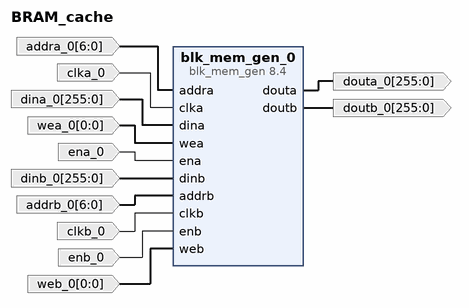
[diagram p0: block diagram of the top level]
# Vivado block design BRAM_cache, xc7s50csga324-2, Vivado 2018.1
create_bd_design BRAM_cache

create_bd_port -dir I -from 6 -to 0 addra_0
create_bd_port -dir I -type clk clka_0
create_bd_port -dir I -from 255 -to 0 dina_0
create_bd_port -dir O -from 255 -to 0 douta_0
create_bd_port -dir I -from 0 -to 0 wea_0
create_bd_port -dir I ena_0
create_bd_port -dir I -from 255 -to 0 dinb_0
create_bd_port -dir O -from 255 -to 0 doutb_0
create_bd_port -dir I -from 6 -to 0 addrb_0
create_bd_port -dir I -type clk clkb_0
create_bd_port -dir I enb_0
create_bd_port -dir I -from 0 -to 0 web_0

create_bd_cell -type ip -vlnv xilinx.com:ip:blk_mem_gen:8.4 blk_mem_gen_0
set_property -dict [list \
  CONFIG.Memory_Type True_Dual_Port_RAM \
  CONFIG.Enable_32bit_Address false \
  CONFIG.Use_Byte_Write_Enable false \
  CONFIG.Algorithm Minimum_Area \
  CONFIG.Assume_Synchronous_Clk false \
  CONFIG.Write_Width_A 256 \
  CONFIG.Write_Depth_A 128 \
  CONFIG.Read_Width_A 256 \
  CONFIG.Write_Width_B 256 \
  CONFIG.Read_Width_B 256 \
  CONFIG.Enable_B Use_ENB_Pin \
  CONFIG.Register_PortA_Output_of_Memory_Primitives false \
  CONFIG.Register_PortB_Output_of_Memory_Primitives false \
  CONFIG.Use_RSTA_Pin false \
  CONFIG.Use_RSTB_Pin false \
  CONFIG.Port_B_Clock 100 \
  CONFIG.Port_B_Write_Rate 50 \
  CONFIG.Port_B_Enable_Rate 100 \
  CONFIG.use_bram_block Stand_Alone \
] [get_bd_cells blk_mem_gen_0]

# ---- connections ----

connect_bd_net -net addra_0_1 [get_bd_ports addra_0] [get_bd_pins blk_mem_gen_0/addra]
connect_bd_net -net clka_0_1 [get_bd_ports clka_0] [get_bd_pins blk_mem_gen_0/clka]
connect_bd_net -net dina_0_1 [get_bd_ports dina_0] [get_bd_pins blk_mem_gen_0/dina]
connect_bd_net [get_bd_pins blk_mem_gen_0/douta] [get_bd_ports douta_0]
connect_bd_net -net wea_0_1 [get_bd_ports wea_0] [get_bd_pins blk_mem_gen_0/wea]
connect_bd_net -net ena_0_1 [get_bd_ports ena_0] [get_bd_pins blk_mem_gen_0/ena]
connect_bd_net -net dinb_0_1 [get_bd_ports dinb_0] [get_bd_pins blk_mem_gen_0/dinb]
connect_bd_net [get_bd_pins blk_mem_gen_0/doutb] [get_bd_ports doutb_0]
connect_bd_net -net addrb_0_1 [get_bd_ports addrb_0] [get_bd_pins blk_mem_gen_0/addrb]
connect_bd_net -net clkb_0_1 [get_bd_ports clkb_0] [get_bd_pins blk_mem_gen_0/clkb]
connect_bd_net -net enb_0_1 [get_bd_ports enb_0] [get_bd_pins blk_mem_gen_0/enb]
connect_bd_net -net web_0_1 [get_bd_ports web_0] [get_bd_pins blk_mem_gen_0/web]

validate_bd_design
save_bd_design
